# EAGLE design brick_3pin_led_3x3 (EAGLE 7.3.0)
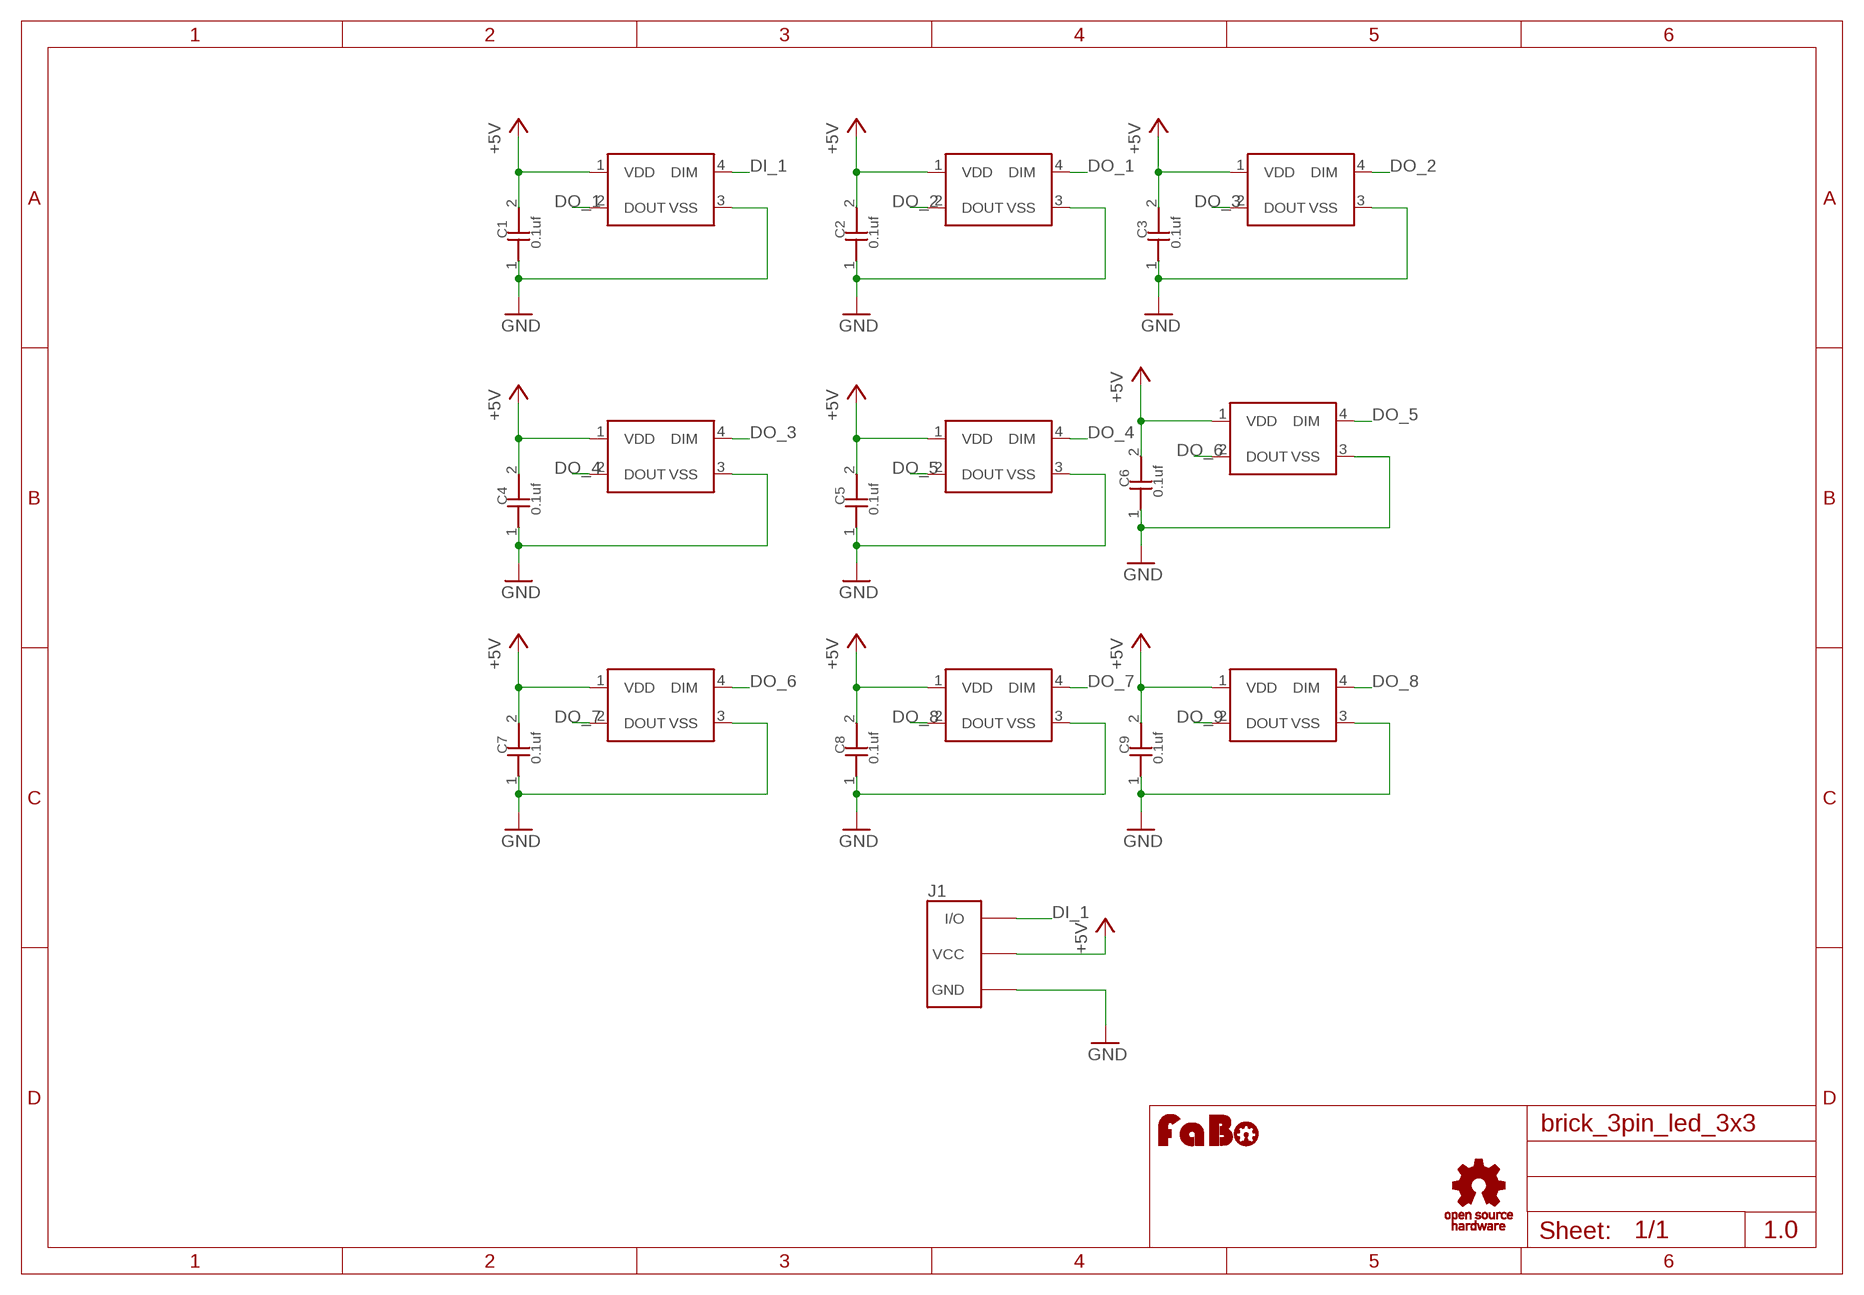
[diagram p0: schematic, sheet 1]

## Parts
C1  0.1uf  CAPACITOR0603  [0603]
C2  0.1uf  CAPACITOR0603  [0603]
C3  0.1uf  CAPACITOR0603  [0603]
C4  0.1uf  CAPACITOR0603  [0603]
C5  0.1uf  CAPACITOR0603  [0603]
C6  0.1uf  CAPACITOR0603  [0603]
C7  0.1uf  CAPACITOR0603  [0603]
C8  0.1uf  CAPACITOR0603  [0603]
C9  0.1uf  CAPACITOR0603  [0603]
J1  BRICK_3PIN_BIG  [BRICK_3PIN_BIG]
LED1  WS2818B  [WS2818B]
LED2  WS2818B  [WS2818B]
LED3  WS2818B  [WS2818B]
LED4  WS2818B  [WS2818B]
LED5  WS2818B  [WS2818B]
LED6  WS2818B  [WS2818B]
LED7  WS2818B  [WS2818B]
LED8  WS2818B  [WS2818B]
LED9  WS2818B  [WS2818B]
U$4  LOGO_OSHW_T-M  [LOGO_OSHW_T_M]
U$5  LOGO_FABO-M  [LOGO_FABO_M]

## Nets
+5V: C1.2 C2.2 C3.2 C4.2 C5.2 C6.2 C7.2 C8.2 C9.2 J1.VCC LED1.1(VDD) LED2.1(VDD) LED3.1(VDD) LED4.1(VDD) LED5.1(VDD) LED6.1(VDD) LED7.1(VDD) LED8.1(VDD) LED9.1(VDD)
DI_1: J1.IN/OUT(I/O) LED1.4(DIM)
DO_1: LED1.2(DOUT) LED2.4(DIM)
DO_2: LED2.2(DOUT) LED3.4(DIM)
DO_3: LED3.2(DOUT) LED4.4(DIM)
DO_4: LED4.2(DOUT) LED5.4(DIM)
DO_5: LED5.2(DOUT) LED6.4(DIM)
DO_6: LED6.2(DOUT) LED7.4(DIM)
DO_7: LED7.2(DOUT) LED8.4(DIM)
DO_8: LED8.2(DOUT) LED9.4(DIM)
DO_9: LED9.2(DOUT)
GND: C1.1 C2.1 C3.1 C4.1 C5.1 C6.1 C7.1 C8.1 C9.1 J1.GND LED1.3(VSS) LED2.3(VSS) LED3.3(VSS) LED4.3(VSS) LED5.3(VSS) LED6.3(VSS) LED7.3(VSS) LED8.3(VSS) LED9.3(VSS)

## Notes on the sheet
- 1.0

## Library data of the parts
C1-C9 = GClue-Capacitor:CAPACITOR
J1 = GClue:BRICK_3PIN: FaBo Brick 3pin
LED1-LED9 = GClue-LED:WS2818B
U$4 = GClue:LOGO_OSHW_T
U$5 = FaBo:LOGO_FABO

## Net classes
0 default: width 0.254 mm

## Board
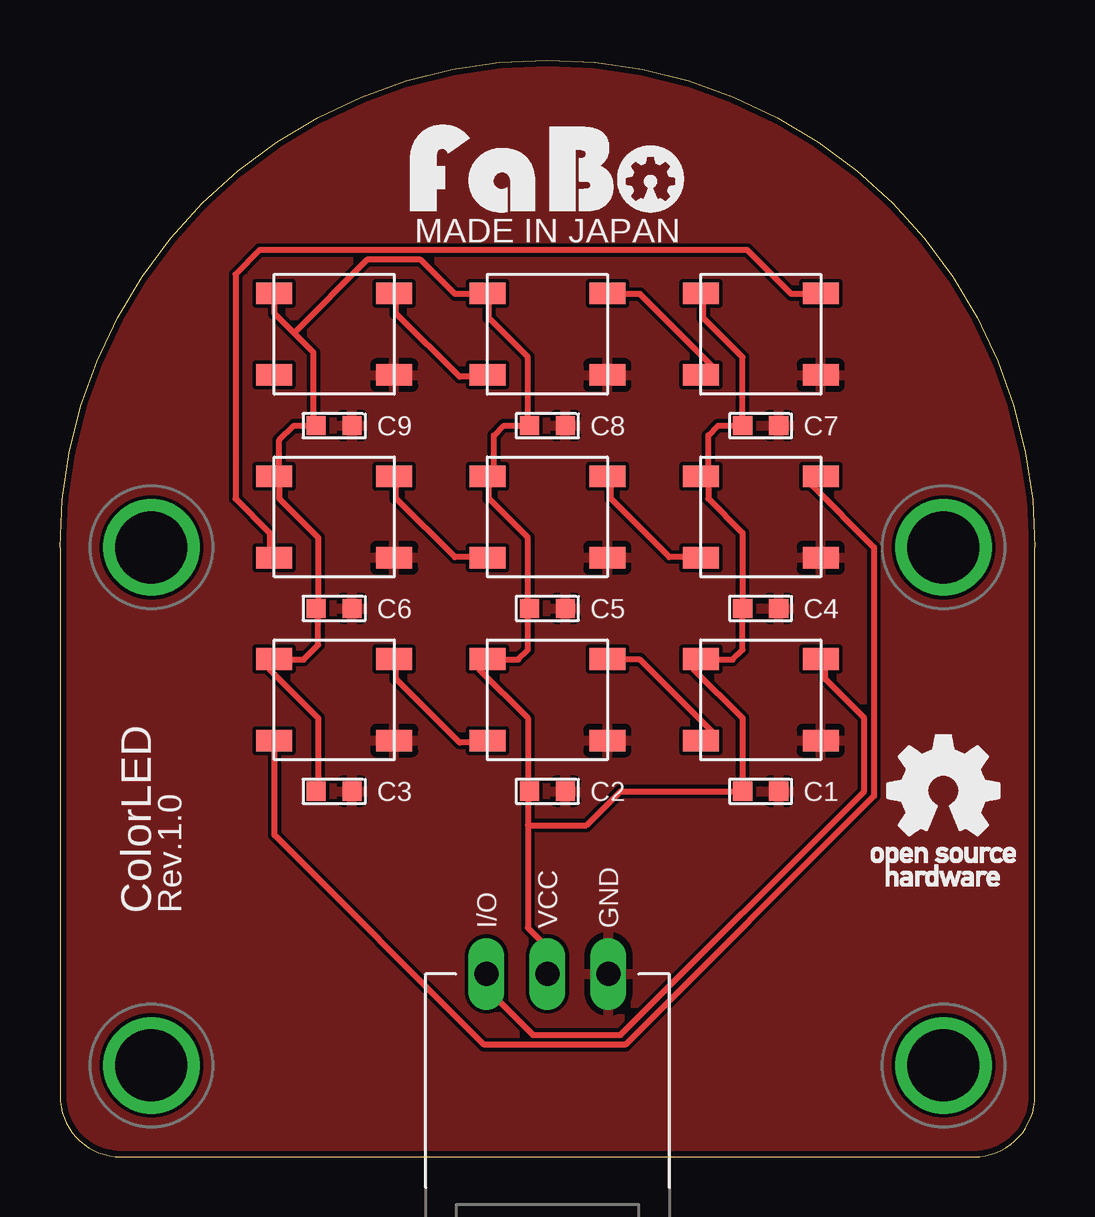
[diagram p1: board, top side]
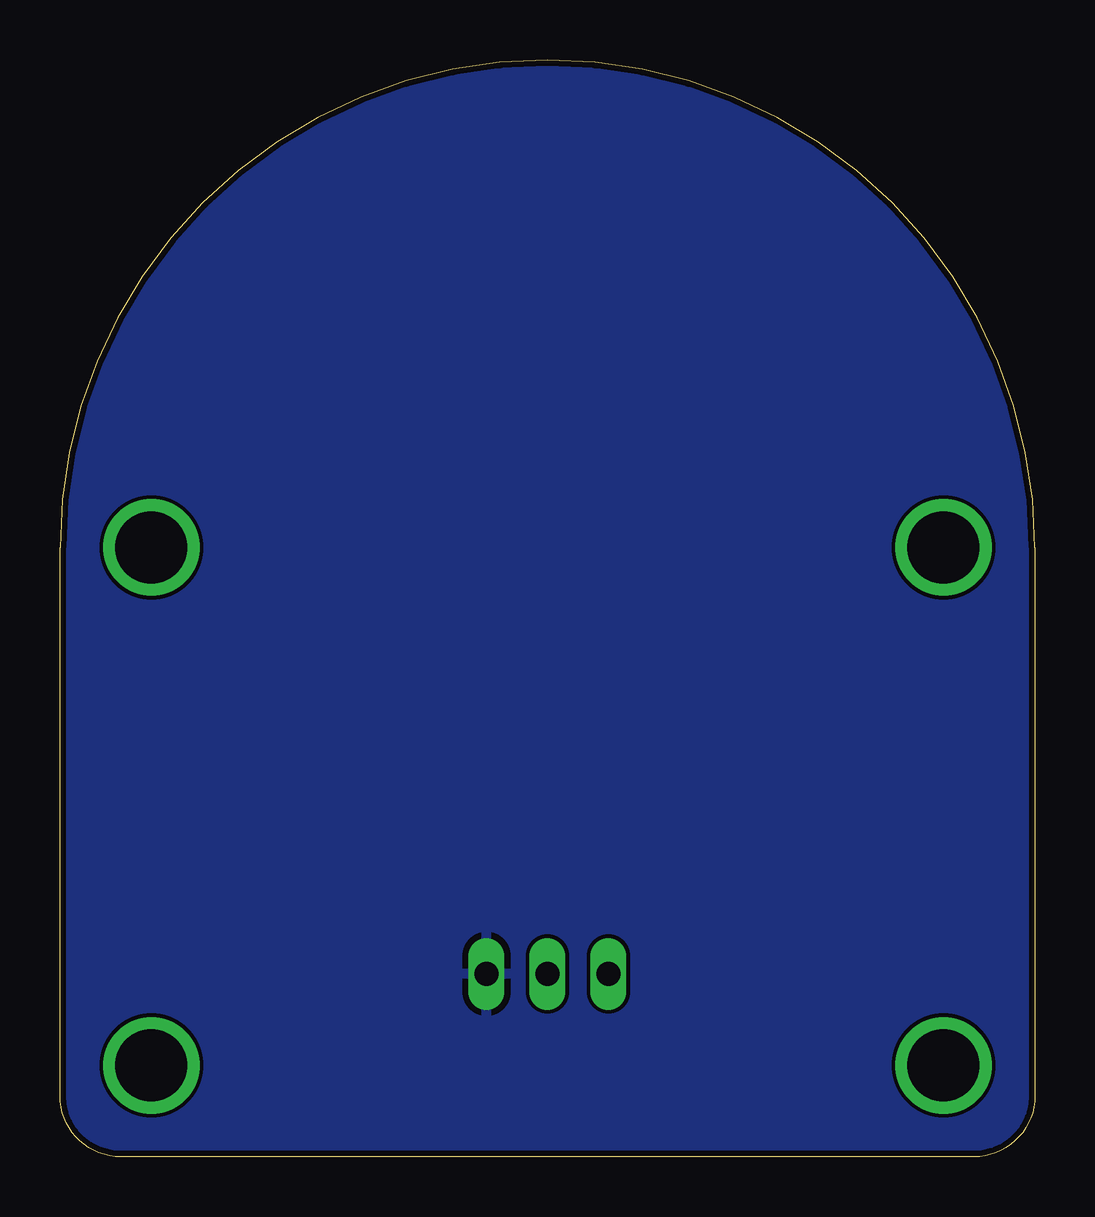
[diagram p2: board, bottom side, seen from below]

Size 40.64 x 45.72 mm. Coordinates in mm from the lower left corner, seen from the top.
Copper layers (1*16): Top 0.035mm / dielectric 1.5mm / Bottom 0.035mm
Design rules "Elecrow_2-layer_eagle_rule": minimum track width 6mil, minimum drill 12mil, track to track 6mil, track to pad 6mil, pad to pad 6mil, via to via 6mil, smd to smd 0mil, copper to edge 10mil, drill to drill 10mil, minimum pad ring 10mil, minimum via ring 6mil, stop-mask expansion 2mil, vias tented up to drill 100mil, thermal gap 10mil

### Footprints (pad centres in the part's own frame; a part is rotated, then mirrored left to right if it is on the bottom)
0603 = smd 0.8 x 0.8: 1 -0.75,0; 2 0.75,0
BRICK_3PIN_BIG = drill 1 long: GND 2.54,-8.89; IN/OUT -2.54,-8.89; VCC 0,-8.89 | drill 3 pad 3.81: P$5 -16.51,8.89; P$6 16.51,8.89; P$7 -16.51,-12.7; P$8 16.51,-12.7
WS2818B = smd 1.5 x 0.9: 1 -2.5,1.7; 2 -2.5,-1.7; 3 2.5,-1.7; 4 2.5,1.7

### Placement (x,y rotation side)
C1  29.21,15.24 180 top
C2  20.32,15.24 180 top
C3  11.43,15.24 180 top
C4  29.21,22.86 180 top
C5  20.32,22.86 180 top
C6  11.43,22.86 180 top
C7  29.21,30.48 180 top
C8  20.32,30.48 180 top
C9  11.43,30.48 180 top
J1  20.32,16.51 0 top
LED1  29.21,19.05 0 top
LED2  20.32,19.05 0 top
LED3  11.43,19.05 0 top
LED4  29.21,26.67 0 top
LED5  20.32,26.67 0 top
LED6  11.43,26.67 0 top
LED7  29.21,34.29 0 top
LED8  20.32,34.29 0 top
LED9  11.43,34.29 0 top
U$4  36.83,15.24 0 top
U$5  20.32,39.37 0 top

### Tracks (layer width: path | path; a pad name or v marks a point on that pad's centre or on a via)
+5V
  Top 0.254: 28.45,15.24 28.45,18.29 26.42,20.32 26.42,20.52 26.62,20.73 LED1.1 26.82,20.73 28.04,20.73 28.45,21.13 28.45,22.76 C4.2 28.45,22.96 28.45,26.01 27.03,27.43 27.03,28.65 | 28.45,30.48 27.43,30.48 27.03,30.07 27.03,28.65 | 27.03,28.65 26.82,28.45 LED4.1 27.03,28.65 | 28.45,30.48 28.45,33.33 26.82,34.95 26.82,35.97 LED7.1 | 28.45,30.48 C7.2 | C3.2 10.77,15.24 10.77,18.29 8.74,20.32 8.74,20.73 LED3.1 8.94,20.73 10.16,20.73 10.77,21.34 10.77,22.76 C6.2 10.77,22.96 10.77,25.81 9.14,27.43 9.14,28.65 | 10.57,30.48 9.75,30.48 9.14,29.87 9.14,28.65 | 9.14,28.65 8.94,28.45 LED6.1 9.14,28.65 | 9.75,34.34 10.57,33.53 10.57,30.48 | 9.75,34.34 8.94,35.15 8.94,35.97 LED9.1 | 10.57,30.48 C9.2 | 19.51,30.48 18.49,30.48 18.09,30.07 18.09,28.65 17.88,28.45 LED5.1 17.88,28.25 17.88,27.43 19.51,25.81 19.51,22.96 C5.2 19.51,22.76 19.51,21.13 19.1,20.73 17.88,20.73 LED2.1 17.68,20.73 17.48,20.52 17.48,20.32 19.51,18.29 19.51,15.24 | 19.51,30.48 19.51,33.33 17.88,34.95 17.88,35.97 LED8.1 17.68,35.97 16.46,35.97 15.04,37.39 12.8,37.39 9.75,34.34 | 19.51,30.48 C8.2 | J1.VCC 20.32,8.74 19.51,9.55 19.51,13.82 | 19.51,15.24 19.51,13.82 | 19.51,15.24 C2.2 | 28.45,15.24 23.37,15.24 21.95,13.82 19.51,13.82 | 28.45,15.24 C1.2
DI_1
  Top 0.254: LED1.4 31.9,20.73 31.9,19.91 33.53,18.29 33.53,15.24 23.37,5.08 19.71,5.08 17.88,6.91 17.88,7.52 J1.IN/OUT
DO_1
  Top 0.254: LED2.4 22.96,20.73 24.18,20.73 27.23,17.68 26.82,17.27 LED1.2
DO_2
  Top 0.254: LED3.4 14.02,20.73 14.02,19.91 16.66,17.27 17.68,17.27 LED2.2
DO_3
  Top 0.254: LED3.2 8.94,17.27 8.94,13.41 17.68,4.67 23.57,4.67 33.93,15.04 33.93,25.4 31.29,28.04 31.7,28.45 LED4.4
DO_4
  Top 0.254: LED5.4 22.96,28.25 22.96,27.43 25.4,24.99 26.62,24.99 LED4.2
DO_5
  Top 0.254: LED6.4 14.02,28.25 14.02,27.43 16.46,24.99 17.68,24.99 LED5.2
DO_6
  Top 0.254: LED6.2 8.74,24.99 8.74,26.01 7.32,27.43 7.32,36.78 8.33,37.8 28.65,37.8 30.48,35.97 31.7,35.97 LED7.4
DO_7
  Top 0.254: LED8.4 22.96,35.97 24.18,35.97 27.23,32.92 26.82,32.51 LED7.2
DO_8
  Top 0.254: LED9.4 14.02,35.97 14.02,35.15 16.66,32.51 17.68,32.51 LED8.2
GND
  pour Bottom: -1.27,-1.27 41.91,-1.27 41.91,46.99 -1.27,46.99
  pour Top: -1.27,-1.27 41.91,-1.27 41.91,46.99 -1.27,46.99

### Text on the board
tPlace: MADE IN JAPAN | ColorLED | Rev.1.0